# Altium schematic sheet RF_Attenuator.SchDoc: RF Attenuator - 0.5db ~ 31.5db
size A4; Organization: Altium Limited; Address1: L3, 12a Rodborough Rd; Address2: Frenchs Forest; Address3: NSW; Address4: Australia 2086; Revision: 1.0; SheetNumber: 1; SheetTotal: 1
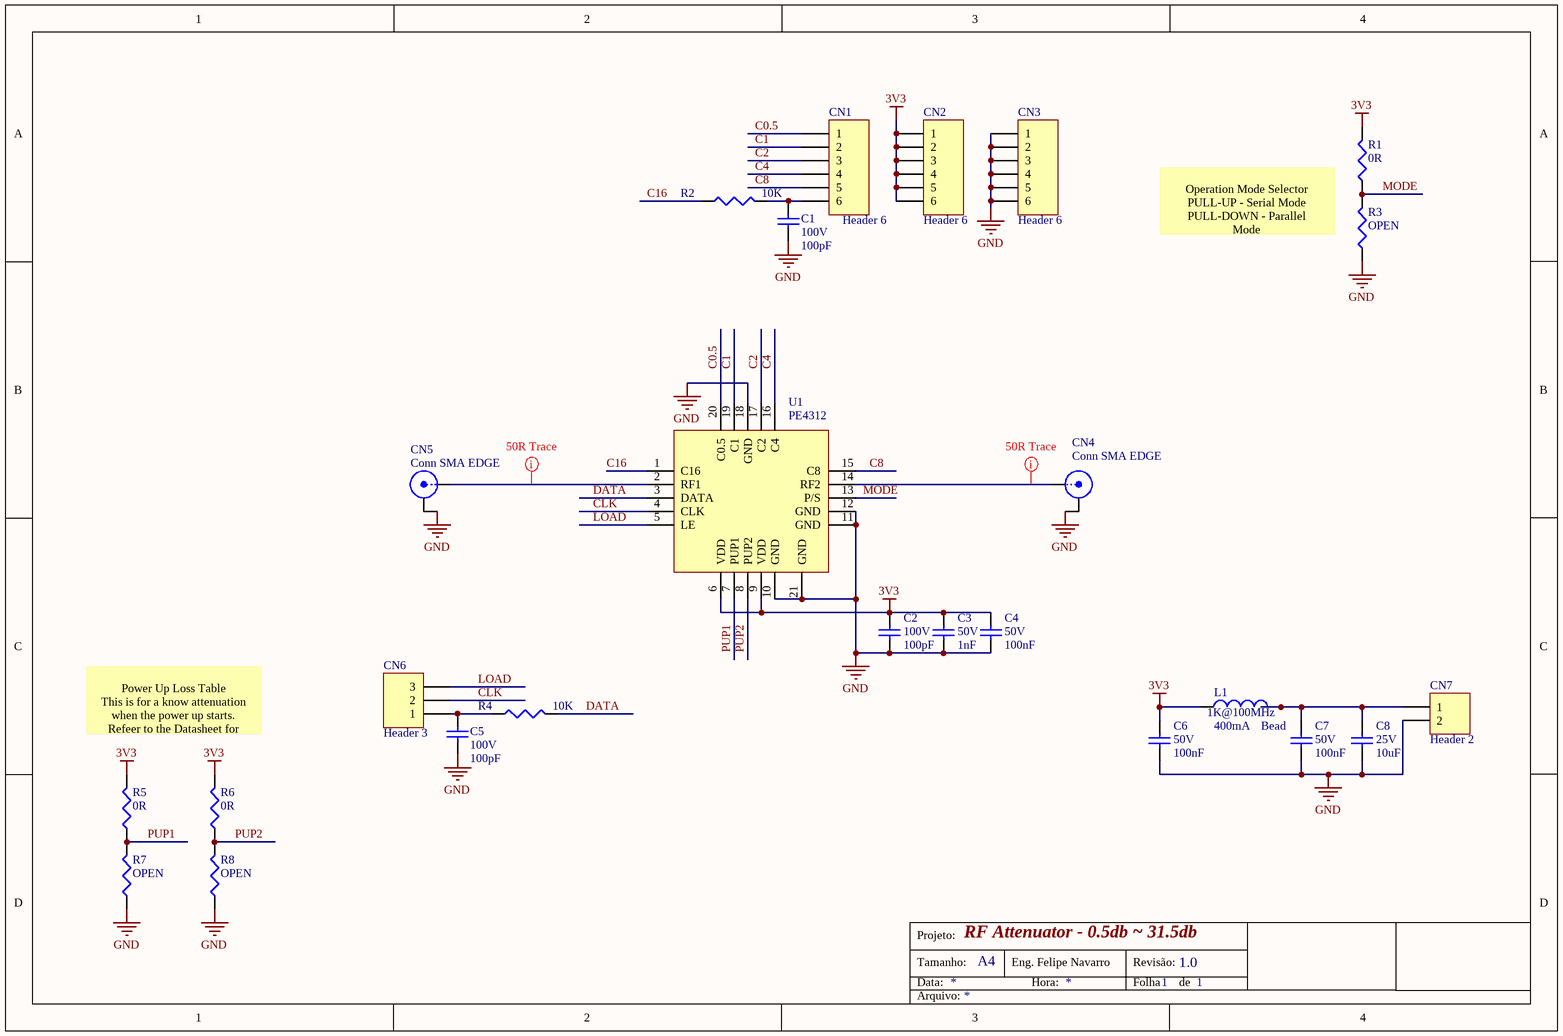
[diagram p0: RF_Attenuator.SchDoc]

## Parts
C1  value 100pF  Tensão: 100V  [CC0603]  (hidden comment: Capacitor Cerâmico)
C2  value 100pF  Tensão: 100V  [CC0603]  (hidden comment: Capacitor Cerâmico)
C3  value 1nF  Tensão: 50V  [CC0603]  (hidden comment: Capacitor Cerâmico)
C4  value 100nF  Tensão: 50V  [CC0603]  (hidden comment: Capacitor Cerâmico)
C5  value 100pF  Tensão: 100V  [CC0603]  (hidden comment: Capacitor Cerâmico)
C6  value 100nF  Tensão: 50V  [CC0603]  (hidden comment: Capacitor Cerâmico)
C7  value 100nF  Tensão: 50V  [CC0603]  (hidden comment: Capacitor Cerâmico)
C8  value 10uF  Tensão: 25V  [CC0805]  (hidden comment: Capacitor Cerâmico)
CN1  Header 6  [CONN HDR1X6]
CN2  Header 6  [CONN HDR1X6]
CN3  Header 6  [CONN HDR1X6]
CN4  Conn SMA EDGE  [CONN SMA EDGE MOUNT]
CN5  Conn SMA EDGE  [CONN SMA EDGE MOUNT]
CN6  Header 3  [CONN HDR1X3]
CN7  Header 2  [CONN HDR1X2]
L1  Bead  value 1K@100MHz  Corrente: 400mA  [CC0603]
R1  value 0R  [CC0603]  (hidden comment: Resistor)
R2  value 10K  [CC0603]  (hidden comment: Resistor)
R3  value OPEN  [CC0603]  (hidden comment: Resistor Open)  (no BOM)
R4  value 10K  [CC0603]  (hidden comment: Resistor)
R5  value 0R  [CC0603]  (hidden comment: Resistor)
R6  value 0R  [CC0603]  (hidden comment: Resistor)
R7  value OPEN  [CC0603]  (hidden comment: Resistor Open)  (no BOM)
R8  value OPEN  [CC0603]  (hidden comment: Resistor Open)  (no BOM)
U1  PE4312  [QFN4X4-20N]

## Nets
3V3: C2.2 C3.2 C4.2 C6.2 CN2.1 CN2.2 CN2.3 CN2.4 CN2.5 CN2.6 L1.1 R1.2 R5.2 R6.2 U1.6(VDD) U1.9(VDD)
GND: C1.1 C2.1 C3.1 C4.1 C5.1 C6.1 C7.1 C8.1 CN3.1 CN3.2 CN3.3 CN3.4 CN3.5 CN3.6 CN4.G CN5.G CN7.2 R3.1 R7.1 R8.1 U1.10(GND) U1.11(GND) U1.12(GND) U1.18(GND) U1.21(GND)
C0.5: CN1.1 U1.20(C0.5)
C1: CN1.2 U1.19(C1)
C2: CN1.3 U1.17(C2)
C4: CN1.4 U1.16(C4)
C8: CN1.5 U1.15(C8)
C16: R2.1 U1.1(C16)
CLK: CN6.2 U1.4(CLK)
DATA: R4.2 U1.3(DATA)
LOAD: CN6.3 U1.5(LE)
MODE: R1.1 R3.2 U1.13(P/S)
PUP1: R5.1 R7.2 U1.7(PUP1)
PUP2: R6.1 R8.2 U1.8(PUP2)
NetC1_2: C1.2 CN1.6 R2.2
NetC5_2: C5.2 CN6.1 R4.1
NetC7_2: C7.2 C8.2 CN7.1 L1.2
NetCN4_S: CN4.S U1.14(RF2)
NetCN5_S: CN5.S U1.2(RF1)

## Layout directives
rule Width Constraint [Pref Width = 1.4mm    Min Width = 1.4mm    Max Width = 1.4mm]; rule Clearance Constraint [Clearance = 0.25mm]: NetCN4_S, NetCN5_S

## Notes on the sheet
- Operation Mode Selector
  PULL-UP - Serial Mode
  PULL-DOWN - Parallel Mode
- Power Up Loss Table
  This is for a know attenuation when the power up starts. Refeer to the Datasheet for proper information.
- Projeto:
- Tamanho:
- Data:
- A4
- Eng. Felipe Navarro
- Hora:
- Revisão:
- Folha
- de
- Arquivo:

## Library data of the parts
C1 C2 C5 = Cap 100pF 100V 0603 NP0: Capacitor (Semiconductor SIM Model); Chinês: -----; ChinesePrice: 0,00000; Corrente: *A; Potência: *W; Obs:: NP0; Tolerância: ±5%; Supplier 1: Digi-Key; Supplier Part Number 1: 1276-1295-1-ND; ComponentLink1Description: Datasheet; ComponentLink1URL: D:\Tecnoclade\Datasheet\!DataMissing.pdf
C3 = Cap 1nF 50V 0603 NP0: Capacitor (Semiconductor SIM Model); Chinês: Local; ChinesePrice: 0,00700; Corrente: *A; Potência: *W; Obs:: NP0; Tolerância: ±5%; Supplier 1: Digi-Key; Supplier Part Number 1: 490-1451-1-ND; ComponentLink1Description: Datasheet; ComponentLink1URL: D:\Tecnoclade\Datasheet\!DataMissing.pdf
C4 C6 C7 = Cap 100nF 50V 0603 X7R: Capacitor (Semiconductor SIM Model); Chinês: Local; ChinesePrice: 0,00250; Corrente: *A; Potência: *W; Obs:: X7R; Tolerância: ±10%; Supplier 1: Digi-Key; Supplier Part Number 1: 1276-1000-1-ND; ComponentLink1Description: Datasheet; ComponentLink1URL: D:\Tecnoclade\Datasheet\!DataMissing.pdf
C8 = Cap 10uF 25V 0805 X5R: Capacitor (Semiconductor SIM Model); Chinês: Local; ChinesePrice: 0,02620; Corrente: *A; Potência: *W; Obs:: X5R; Tolerância: ±10%; Supplier 1: Digi-Key; Supplier Part Number 1: 587-2985-1-ND; ComponentLink1Description: Datasheet; ComponentLink1URL: D:\Tecnoclade\Datasheet\!DataMissing.pdf
CN1-CN3 = Header 6: Header, 6-Pin; ChinesePrice: 0,10000; Chinês: Proved - Local; Value: Barra de 40 pinos - ATENÇÃO; Corrente: *; Potência: *; Supplier 1: Digi-Key; Supplier Part Number 1: A26509-40-ND; Tensão: *; Obs:: *; Tolerância: *; ComponentLink1Description: Datasheet; ComponentLink1URL: D:\Tecnoclade\Datasheet\!DataMissing.pdf
CN4 CN5 = Conn SMA EDGE: Conector SMA; ChinesePrice: 0,00000; Chinês: ----; Corrente: *; Potência: *; Supplier 1: Digi-Key; Supplier Part Number 1: WM5534-ND; Tensão: *; Value: SMA; Obs:: *; Tolerância: *; ComponentLink1Description: Datasheet; ComponentLink1URL: D:\Tecnoclade\Datasheet\!DataMissing.pdf
CN6 = Header 3: Header, 3-Pin; ChinesePrice: 0,10000; Chinês: Proved - Local; Value: Barra de 40 pinos - ATENÇÃO; Corrente: *; Potência: *; Supplier 1: Digi-Key; Supplier Part Number 1: A26509-40-ND; Tensão: *; Obs:: *; Tolerância: *; ComponentLink1Description: Datasheet; ComponentLink1URL: D:\Tecnoclade\Datasheet\!DataMissing.pdf
CN7 = Header 2: Header, 2-Pin; ChinesePrice: 0,10000; Chinês: Proved - Local; Value: Barra de 40 pinos - ATENÇÃO; Corrente: *; Potência: *; Supplier 1: Digi-Key; Supplier Part Number 1: A26509-40-ND; Tensão: *; Obs:: *; Tolerância: *; ComponentLink1Description: Datasheet; ComponentLink1URL: D:\Tecnoclade\Datasheet\!DataMissing.pdf
L1 = Bd 1K@100MHz 0603 400mA: ChinesePrice: 0,00000; Chinês: -----; Obs:: Ferrite (0R5); Tolerância: ±25%; Potência: *; Supplier 1: Digi-Key; Supplier Part Number 1: 445-1550-1-ND; Tensão: *; ComponentLink1Description: Datasheet; ComponentLink1URL: D:\Tecnoclade\Datasheet\!DataMissing.pdf; Substituição: 27/06/2014
R1 R5 R6 = Res 0R 0603 1/10W: ChinesePrice: 0,00089; Chinês: Local; Corrente: *A; Potência: 1/10W; Tensão: *V; Tolerância: Jumper; Supplier 1: Digi-Key; Supplier Part Number 1: P0.0GCT-ND; Obs: *; ComponentLink1Description: Datasheet; ComponentLink1URL: D:\Tecnoclade\Datasheet\!DataMissing.pdf
R2 R4 = Res 10K 1% 0603 1/10W: ChinesePrice: 0,00089; Chinês: Local; Corrente: *A; Potência: 1/10W; Tensão: *V; Tolerância: ±1%; Supplier 1: Digi-Key; Supplier Part Number 1: P10.0KHCT-ND; Obs: *; ComponentLink1Description: Datasheet; ComponentLink1URL: D:\Tecnoclade\Datasheet\!DataMissing.pdf
R3 R7 R8 = Res Open 0603: Resistor; ChinesePrice: 0,00000; Chinês: ----; Corrente: *A; Potência: *W; Tensão: *V; Tolerância: ±*%; Supplier 1: Digi-Key; Supplier Part Number 1: --Del; Obs:: *; ComponentLink1Description: Datasheet; ComponentLink1URL: D:\Tecnoclade\Datasheet\!DataMissing.pdf
U1 = PE4312: UltraCMOS® RF Digital Step Attenuator 6-bit, 31.5 dB, 1 MHz–4 GHz; ChinesePrice: 0,00000; Chinês: ----; Corrente: *; Potência: *; Supplier 1: Digi-Key; Supplier Part Number 1: 1046-1098-1-ND; Tensão: *; Value: *; Obs:: *; Tolerância: *; ComponentLink1Description: Datasheet; ComponentLink1URL: D:\Tecnoclade\Datasheet\MCP3914.pdf